# EAGLE design Stm-blth connector (EAGLE 9.2.1)
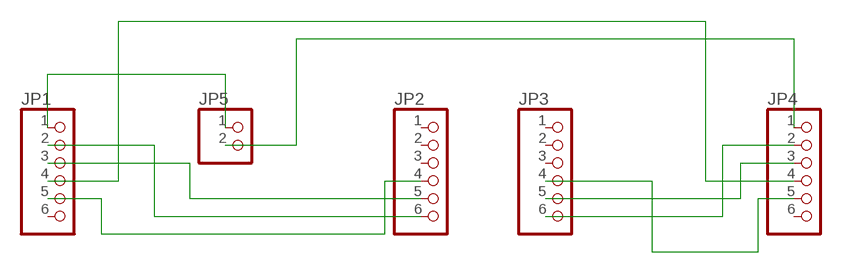
[diagram p0: schematic, sheet 1]

## Parts
JP1  PINHD-1X6  [1X06]
JP2  PINHD-1X6  [1X06]
JP3  PINHD-1X6  [1X06]
JP4  PINHD-1X6  [1X06]
JP5  PINHD-1X2  [1X02]

## Nets
GND: JP1.4 JP4.4
N$1: JP1.1 JP5.1
N$2: JP4.1 JP5.2
N$3: JP1.2 JP2.6
N$4: JP3.6 JP4.2
N$5: JP1.3 JP2.5
N$6: JP3.5 JP4.3
N$8: JP1.5 JP2.4
N$9: JP3.4 JP4.5
Unconnected: JP1.6 JP2.1 JP2.2 JP2.3 JP3.1 JP3.2 JP3.3 JP4.6

## Library data of the parts
JP1-JP4 = pinhead:PINHD-1X6: PIN HEADER
JP5 = pinhead:PINHD-1X2: PIN HEADER

## Board
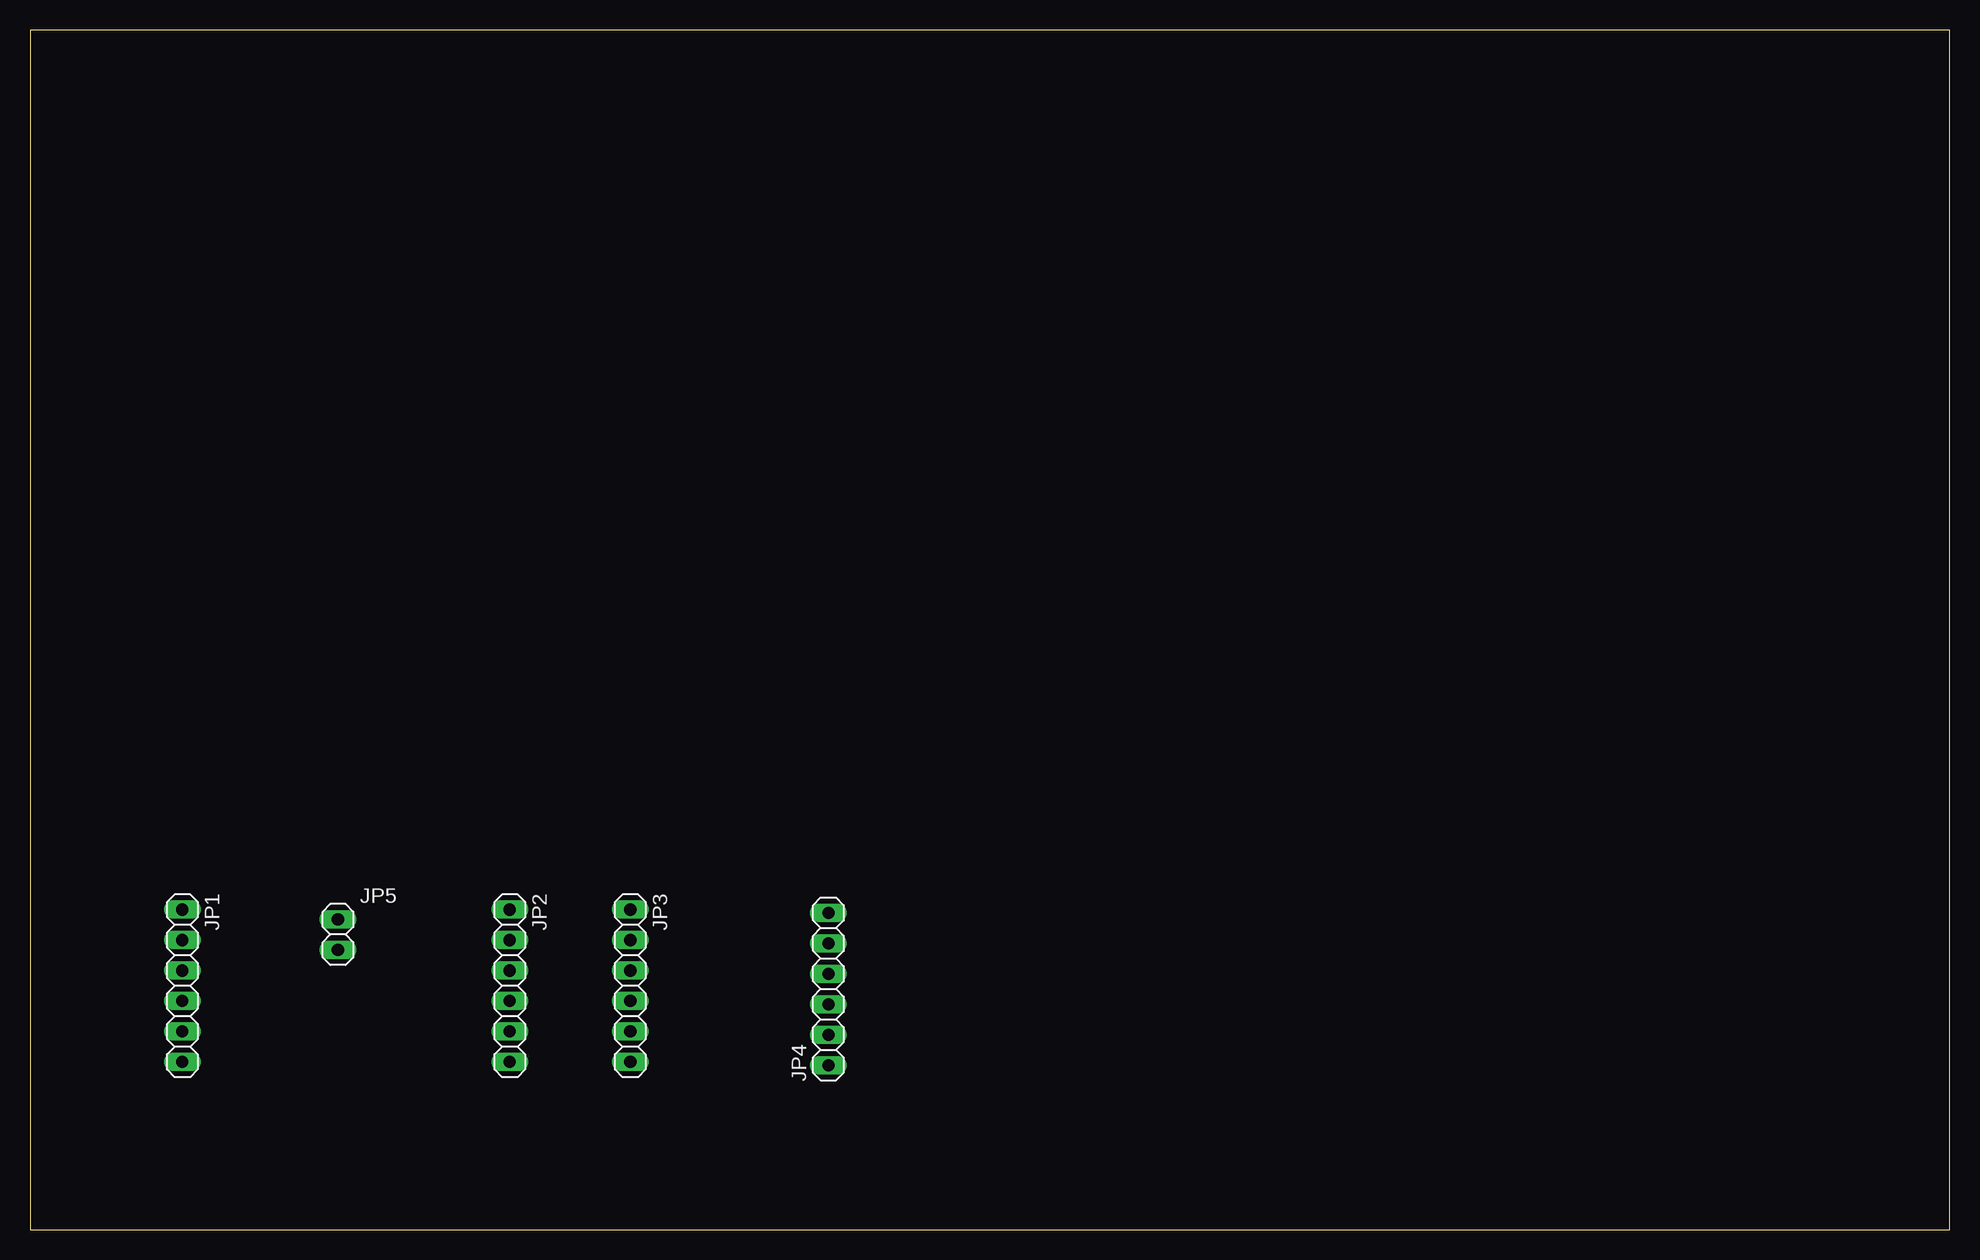
[diagram p1: board, top side]
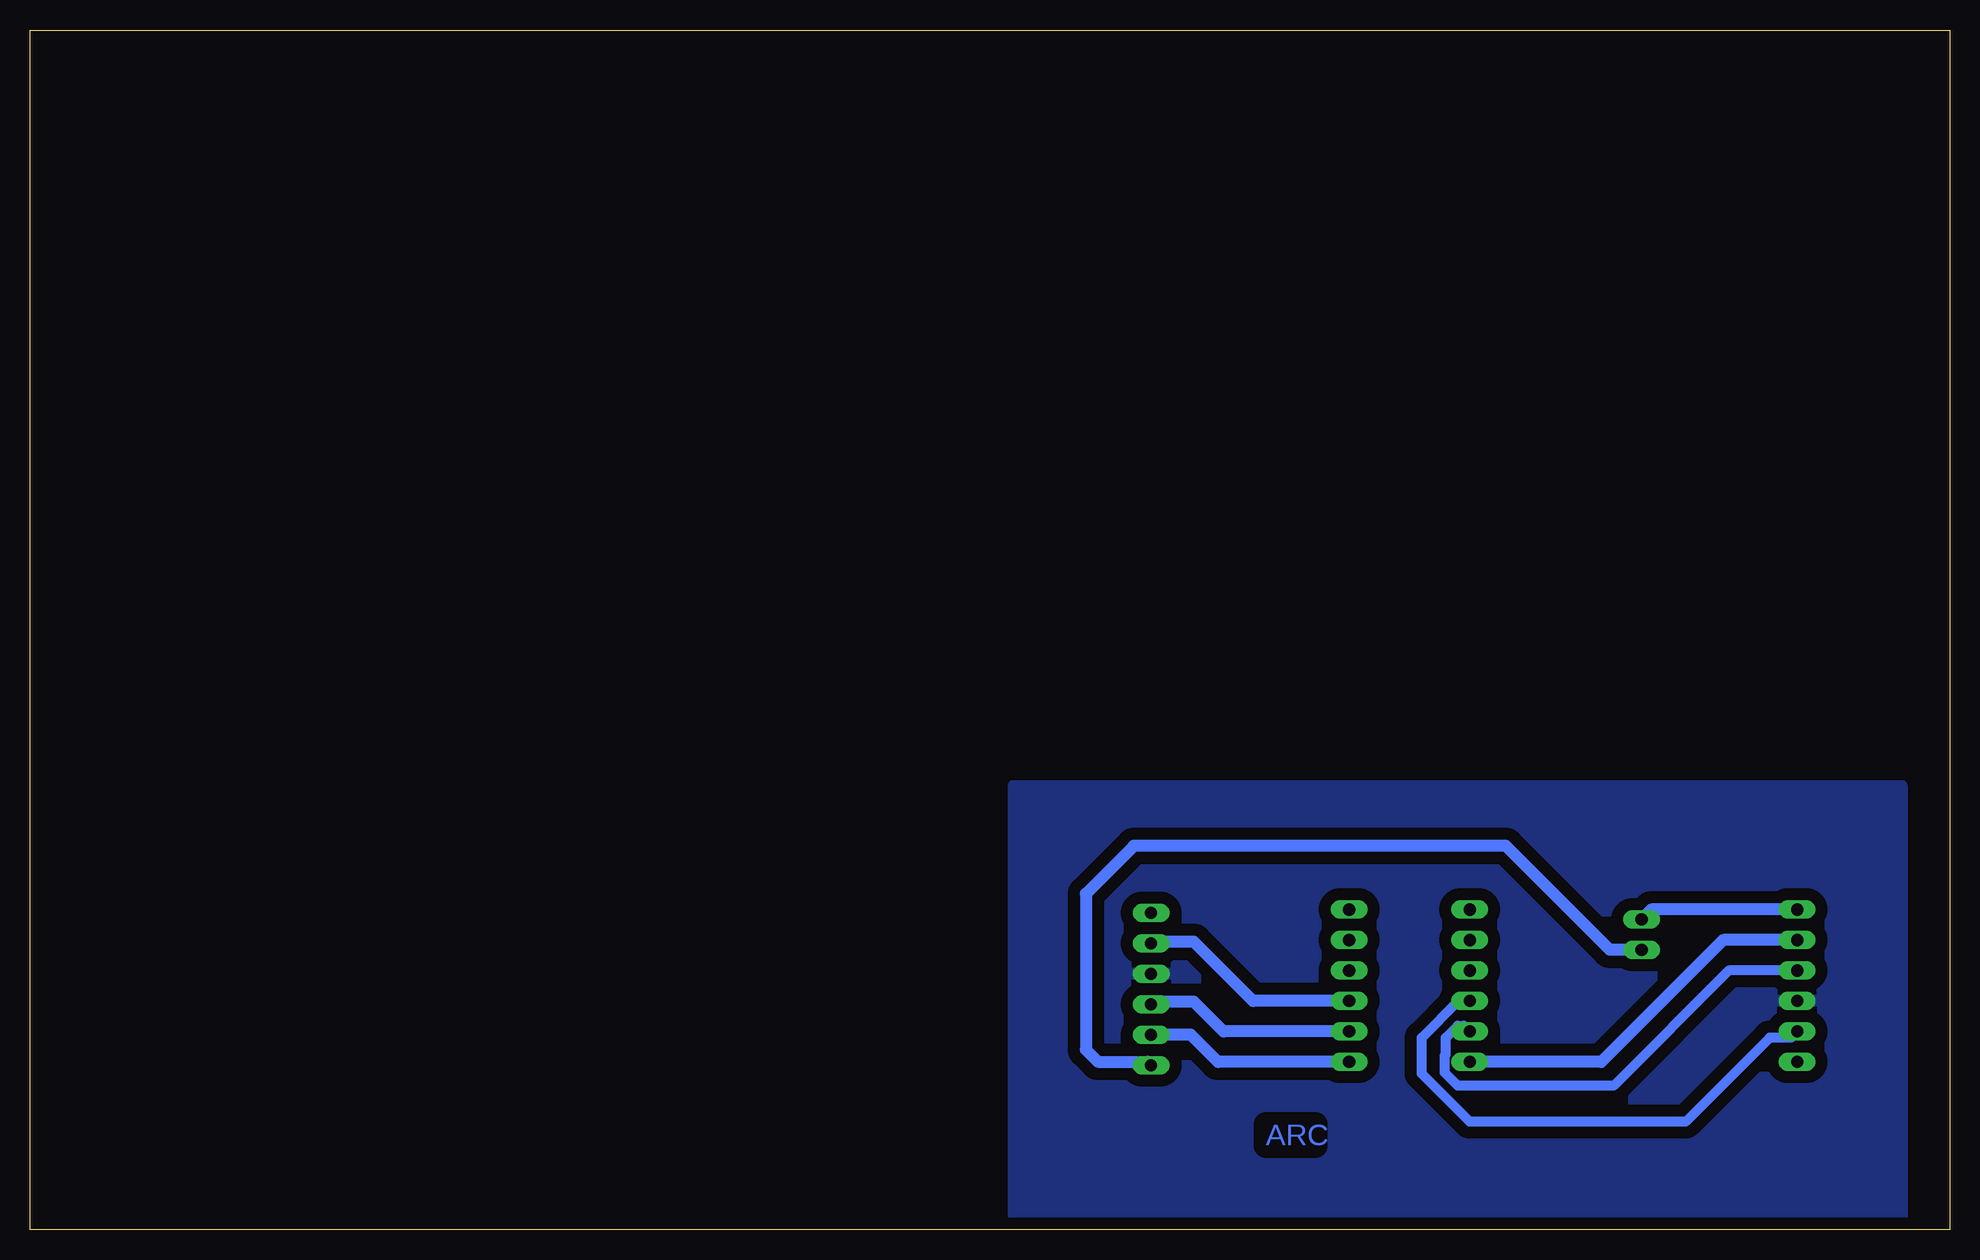
[diagram p2: board, bottom side, seen from below]

Size 160 x 100 mm. Coordinates in mm from the lower left corner, seen from the top.
Outline: 0,0 160,0 160,100 0,100 0,0
Copper layers (1*16): Top 0.035mm / dielectric 1.5mm / Bottom 0.035mm
Design rules "default": minimum track width 6mil, minimum drill 0.35mm, track to track 6mil, track to pad 6mil, pad to pad 6mil, via to via 6mil, smd to smd 6mil, copper to edge 40mil, drill to drill 6mil, minimum pad ring 10mil, minimum via ring 8mil, stop-mask expansion 4mil, vias tented up to drill 0mil, thermal gap 10mil

### Footprints (pad centres in the part's own frame; a part is rotated, then mirrored left to right if it is on the bottom)
1X06 = drill 1.016 long: 1 -6.35,0; 2 -3.81,0; 3 -1.27,0; 4 1.27,0; 5 3.81,0; 6 6.35,0
1X02 = drill 1.016 long: 1 -1.27,0; 2 1.27,0

### Placement (x,y rotation side)
JP1  12.7,20.32 270 top
JP2  39.99,20.32 270 top
JP3  50.04,20.32 270 top
JP4  66.55,20.05 90 top
JP5  25.67,24.59 270 top

### Tracks (layer width: path | path; a pad name or v marks a point on that pad's centre or on a via)
GND
  pour Bottom (isolate 1.016): 4,37 4,1 78,1 78,37
N$1
  Bottom 1.016: JP1.1 24.86,26.67 JP5.1
N$2
  Bottom 1.016: JP5.2 28.32,23.32 37,32 68,32 72,28 72,15 71,14 66.85,14 JP4.1
N$3
  Bottom 1.016: JP1.2 18.87,24.13 29.03,13.97 JP2.6
N$4
  Bottom 1.016: JP3.6 60.97,13.97 63.24,16.24 JP4.2
N$5
  Bottom 0.813: JP1.3 18.41,21.59 28,12 41,12 42.07,13.07 42.07,14.52 42,14.59 42,16 41,17 40.48,17 JP2.5
N$6
  Bottom 1.016: JP3.5 60.51,16.51 63,19 66.33,19 JP4.3
N$8
  Bottom 0.813: JP1.5 13.21,16 15,16 22,9 40,9 44,13 44,16 40.95,19.05 JP2.4
N$9
  Bottom 1.016: JP3.4 58.05,19.05 63,24 66.41,24 JP4.5

### Text on the board
Bottom: ARC